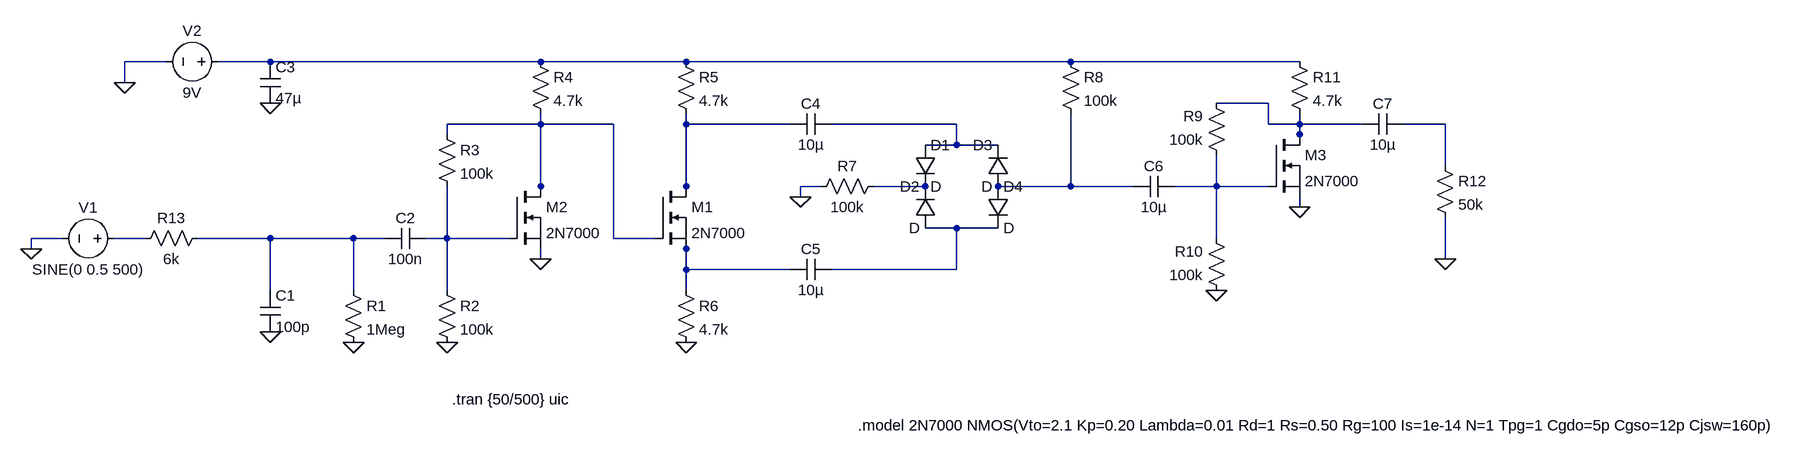
[diagram p0: schematic Octave Pedal.asc]
Octave Pedal.asc, the LTspice schematic file:
Version 4.1
SHEET 1 2996 680
WIRE -160 -208 -224 -208
WIRE 0 -208 -80 -208
WIRE 416 -208 0 -208
WIRE 640 -208 416 -208
WIRE 1232 -208 640 -208
WIRE 1584 -208 1232 -208
WIRE -224 -176 -224 -208
WIRE 1536 -144 1456 -144
WIRE 416 -112 416 -128
WIRE 416 -112 272 -112
WIRE 528 -112 416 -112
WIRE 640 -112 640 -128
WIRE 800 -112 640 -112
WIRE 1056 -112 864 -112
WIRE 1536 -112 1536 -144
WIRE 1584 -112 1584 -128
WIRE 1584 -112 1536 -112
WIRE 1680 -112 1584 -112
WIRE 1808 -112 1744 -112
WIRE 272 -96 272 -112
WIRE 1584 -96 1584 -112
WIRE 1056 -80 1056 -112
WIRE 1056 -80 1008 -80
WIRE 1120 -80 1056 -80
WIRE 1584 -80 1584 -96
WIRE 1808 -48 1808 -112
WIRE 416 -16 416 -112
WIRE 640 -16 640 -112
WIRE 848 -16 816 -16
WIRE 1008 -16 928 -16
WIRE 1232 -16 1232 -128
WIRE 1232 -16 1120 -16
WIRE 1328 -16 1232 -16
WIRE 1456 -16 1456 -64
WIRE 1456 -16 1392 -16
WIRE 1536 -16 1456 -16
WIRE 416 0 416 -16
WIRE 640 0 640 -16
WIRE 816 0 816 -16
WIRE 1584 16 1584 0
WIRE 1056 48 1008 48
WIRE 1120 48 1056 48
WIRE -320 64 -368 64
WIRE -192 64 -240 64
WIRE 0 64 -112 64
WIRE 128 64 0 64
WIRE 176 64 128 64
WIRE 272 64 272 -16
WIRE 272 64 240 64
WIRE 368 64 272 64
WIRE 528 64 528 -112
WIRE 592 64 528 64
WIRE 1456 64 1456 -16
WIRE -368 80 -368 64
WIRE 640 80 640 64
WIRE 416 96 416 80
WIRE 1808 96 1808 32
WIRE 640 112 640 80
WIRE 800 112 640 112
WIRE 1056 112 1056 48
WIRE 1056 112 864 112
WIRE 0 144 0 64
WIRE 128 144 128 64
WIRE 272 144 272 64
WIRE 640 144 640 112
FLAG 0 208 0
FLAG 128 224 0
FLAG 272 224 0
FLAG 640 224 0
FLAG 416 96 0
FLAG 1456 144 0
FLAG 1584 16 0
FLAG -368 80 0
FLAG 0 -144 0
FLAG 816 0 0
FLAG 1808 96 0
FLAG -224 -176 0
SYMBOL cap -16 144 R0
SYMATTR InstName C1
SYMATTR Value 100p
SYMBOL res 112 128 R0
SYMATTR InstName R1
SYMATTR Value 1Meg
SYMBOL res 256 128 R0
SYMATTR InstName R2
SYMATTR Value 100k
SYMBOL cap 240 48 R90
WINDOW 0 0 32 VBottom 2
WINDOW 3 32 32 VTop 2
SYMATTR InstName C2
SYMATTR Value 100n
SYMBOL res 256 -112 R0
SYMATTR InstName R3
SYMATTR Value 100k
SYMBOL cap -16 -208 R0
SYMATTR InstName C3
SYMATTR Value 47µ
SYMBOL res 400 -224 R0
SYMATTR InstName R4
SYMATTR Value 4.7k
SYMBOL res 624 -224 R0
SYMATTR InstName R5
SYMATTR Value 4.7k
SYMBOL res 624 128 R0
SYMATTR InstName R6
SYMATTR Value 4.7k
SYMBOL diode 992 -80 R0
SYMATTR InstName D1
SYMBOL diode 1136 -16 R180
WINDOW 0 24 64 Left 2
WINDOW 3 24 0 Left 2
SYMATTR InstName D3
SYMBOL cap 864 -128 R90
WINDOW 0 0 32 VBottom 2
WINDOW 3 32 32 VTop 2
SYMATTR InstName C4
SYMATTR Value 10µ
SYMBOL cap 864 96 R90
WINDOW 0 0 32 VBottom 2
WINDOW 3 32 32 VTop 2
SYMATTR InstName C5
SYMATTR Value 10µ
SYMBOL res 944 -32 R90
WINDOW 0 0 56 VBottom 2
WINDOW 3 32 56 VTop 2
SYMATTR InstName R7
SYMATTR Value 100k
SYMBOL res 1216 -224 R0
SYMATTR InstName R8
SYMATTR Value 100k
SYMBOL cap 1392 -32 R90
WINDOW 0 0 32 VBottom 2
WINDOW 3 32 32 VTop 2
SYMATTR InstName C6
SYMATTR Value 10µ
SYMBOL res 1472 -48 R180
WINDOW 0 36 76 Left 2
WINDOW 3 36 40 Left 2
SYMATTR InstName R9
SYMATTR Value 100k
SYMBOL res 1472 160 R180
WINDOW 0 36 76 Left 2
WINDOW 3 36 40 Left 2
SYMATTR InstName R10
SYMATTR Value 100k
SYMBOL res 1568 -224 R0
SYMATTR InstName R11
SYMATTR Value 4.7k
SYMBOL cap 1744 -128 R90
WINDOW 0 0 32 VBottom 2
WINDOW 3 32 32 VTop 2
SYMATTR InstName C7
SYMATTR Value 10µ
SYMBOL res 1792 -64 R0
SYMATTR InstName R12
SYMATTR Value 50k
SYMBOL voltage -224 64 R90
WINDOW 0 -32 56 VBottom 2
WINDOW 3 32 56 VTop 2
WINDOW 123 0 0 Left 0
WINDOW 39 0 0 Left 0
SYMATTR InstName V1
SYMATTR Value SINE(0 0.5 500)
SYMBOL res -96 48 R90
WINDOW 0 0 56 VBottom 2
WINDOW 3 32 56 VTop 2
SYMATTR InstName R13
SYMATTR Value 6k
SYMBOL voltage -64 -208 R90
WINDOW 0 -32 56 VBottom 2
WINDOW 3 32 56 VTop 2
WINDOW 123 0 0 Left 0
WINDOW 39 0 0 Left 0
SYMATTR InstName V2
SYMATTR Value 9V
SYMBOL diode 1024 48 R180
WINDOW 0 24 64 Left 2
WINDOW 3 24 0 Left 2
SYMATTR InstName D2
SYMBOL diode 1104 -16 R0
SYMATTR InstName D4
SYMBOL nmos 592 -16 R0
SYMATTR InstName M1
SYMATTR Value 2N7000
SYMBOL nmos 368 -16 R0
SYMATTR InstName M2
SYMATTR Value 2N7000
SYMBOL nmos 1536 -96 R0
SYMATTR InstName M3
SYMATTR Value 2N7000
TEXT 280 312 Left 2 !.tran {50/500} uic
TEXT 904 352 Left 2 !.model 2N7000 NMOS(Vto=2.1 Kp=0.20 Lambda=0.01 Rd=1 Rs=0.50 Rg=100 Is=1e-14 N=1 Tpg=1 Cgdo=5p Cgso=12p Cjsw=160p)

The netlist it stands for:
* Octave Pedal.asc
C1 N012 0 100p
R1 N012 0 1Meg
R2 N013 0 100k
C2 N013 N012 100n
R3 N003 N013 100k
C3 N001 0 47µ
R4 N001 N003 4.7k
R5 N001 N004 4.7k
R6 N014 0 4.7k
D1 N005 N007 D
D3 N008 N005 D
C4 N005 N004 10µ
C5 N010 N014 10µ
R7 N007 0 100k
R8 N001 N008 100k
C6 N009 N008 10µ
R9 N009 N002 100k
R10 0 N009 100k
R11 N001 N002 4.7k
C7 N006 N002 10µ
R12 N006 0 50k
V1 N011 0 SINE(0 0.5 500)
R13 N012 N011 6k
V2 N001 0 9V
D2 N010 N007 D
D4 N008 N010 D
M1 N004 N003 N014 N014 2N7000
M2 N003 N013 0 0 2N7000
M3 N002 N009 0 0 2N7000
.model D D
.lib standard.dio
.model NMOS NMOS
.model PMOS PMOS
.lib standard.mos
.tran {50/500} uic
.model 2N7000 NMOS(Vto=2.1 Kp=0.20 Lambda=0.01 Rd=1 Rs=0.50 Rg=100 Is=1e-14 N=1 Tpg=1 Cgdo=5p Cgso=12p Cjsw=160p)
.backanno
.end